# Altium schematic sheet PLD_RadFET_Differential_Lowpass.SchDoc: Differential low-pass filter
size A4; Revision: 1; SheetTotal: 32; Model: DM1
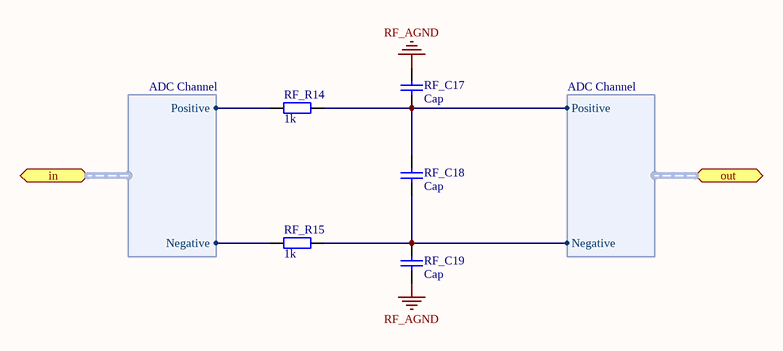
[diagram p0: PLD_RadFET_Differential_Lowpass.SchDoc]

## Parts
RF_C17  Cap  [SMD_Capacitor_0603]
RF_C18  Cap  [SMD_Capacitor_0603]
RF_C19  Cap  [SMD_Capacitor_0603]
RF_R14  1k  [SMD_Resistor_0603]
RF_R15  1k  [SMD_Resistor_0603]

## Ports
in (harness ADC Channel), out (harness ADC Channel)

## Harnesses
ADC Channel: Positive, Negative

## Nets
RF_AGND: RF_C17.1 RF_C19.2
NetRF_C17_2: RF_C17.2 RF_C18.1 RF_R14.2 ; port out.Positive
NetRF_C18_2: RF_C18.2 RF_C19.1 RF_R15.2 ; port out.Negative
NetRF_R14_1: RF_R14.1 ; port in.Positive
NetRF_R15_1: RF_R15.1 ; port in.Negative

## Notes on the sheet
- Title:
- Project:
- Author:
- Model:
- Document Number:
- Checked by:
- Rev:
- Date:
- Approved by:
- Sheet:
- of
- File name:

## Library data of the parts
RF_R14 RF_R15 = Res: Value: 1k; Package: 0603
RF_C17-RF_C19 = Cap: Value: Cap; Package: 0603